# Altium project SlimmeMeterESP.PrjPcb
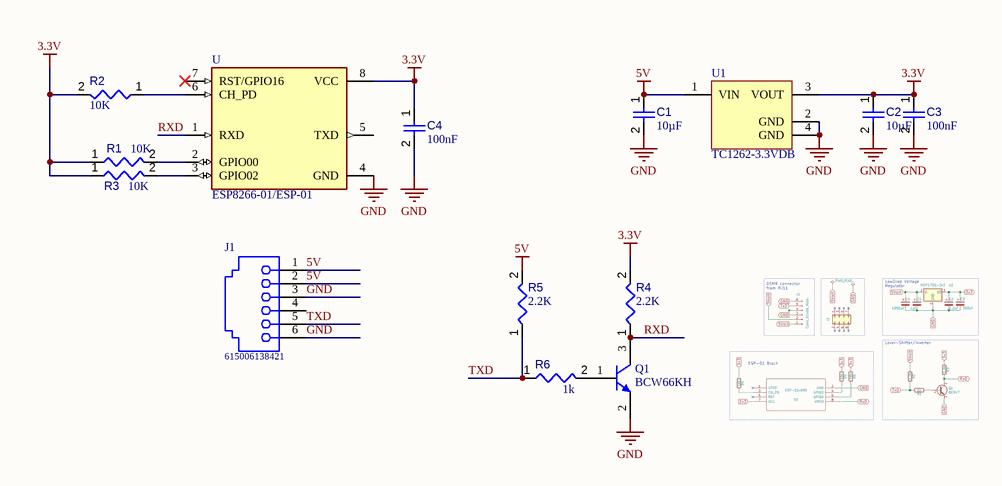
[diagram p0: Schema.SchDoc]
1 sheet, 14 parts. Net scope: global (net labels, ports and power ports of the same name join across sheets).
Board file: Schema.PcbDoc

## Sheet Schema.SchDoc
size A4; SheetNumber: 1; SheetTotal: 1

### Parts
C1  value 10µF  [CAPC0805(2012)145_L]  (hidden comment: Capacitor 10µF +/-20% 25V 0805)
C2  value 10µF  [CAPC0805(2012)145_L]  (hidden comment: Capacitor 10µF +/-20% 25V 0805)
C3  value 100nF  [CAPC1608X90X40NL10T20]  (hidden comment: Capacitor 100 nF +/-10% 50 V 0603)
C4  value 100nF  [CAPC1608X90X40NL10T20]  (hidden comment: Capacitor 100 nF +/-10% 50 V 0603)
J1  615006138421  [615006138421]
Q1  BCW66KH  [INF-SOT23_L]
R1  value 10K  [RESC1608X55X25ML10T15]  (hidden comment: Resistor 100k +/-1% 0603 100 mW)
R2  value 10K  [RESC1608X55X25ML10T15]  (hidden comment: Resistor 100k +/-1% 0603 100 mW)
R3  value 10K  [RESC1608X55X25ML10T15]  (hidden comment: Resistor 100k +/-1% 0603 100 mW)
R4  value 2.2K  [RESC1608X55X25ML10T15]  (hidden comment: Resistor 100k +/-1% 0603 100 mW)
R5  value 2.2K  [RESC1608X55X25ML10T15]  (hidden comment: Resistor 100k +/-1% 0603 100 mW)
R6  value 1k  [RESC1608X55X25ML10T15]  (hidden comment: Resistor 100k +/-1% 0603 100 mW)
U  ESP8266-01/ESP-01  [XCVR_ESP8266-01/ESP-01]
U1  TC1262-3.3VDB  [SOT-223-DB3_L]

### Nets
3.3V: C2.1 C3.1 C4.1 R1.1 R2.2 R3.1 R4.2 U.8(VCC) U1.3(VOUT)
5V: C1.1 J1.1 J1.2 R5.2 U1.1(VIN)
GND: C1.2 C2.2 C3.2 C4.2 J1.3 J1.6 Q1.2(E) U.4(GND) U1.2(GND) U1.4(GND)
RXD: Q1.3(C) R4.1 U.1(RXD)
TXD: J1.5 R5.1 R6.1
NetQ1_1: Q1.1(B) R6.2
NetR1_2: R1.2 U.2(GPIO00)
NetR2_1: R2.1 U.6(CH_PD)
NetR3_2: R3.2 U.3(GPIO02)

Not connected (* = marked no-connect by the designer): J1 4; U 5(TXD) 7(RST/GPIO16)*

### Library data of the parts
C1 C2 = CMP-001-00079-3: Chip Capacitor, 10µF +/-20%, 25V, 0805, Thickness 1.45 mm; Tolerance: 10%; Pins: 2; Case/Package: 0805; Voltage Rating: 25V; Min Operating Temperature: -55°C; Max Operating Temperature: 85°C; Mounting Technology: SMT
C3 C4 = CMP-001-00017-5: Chip Capacitor, 100 nF, +/- 10%, 50 V, 0603 (1608 Metric); Voltage Rating: 50V; Capacitor Type: Ceramic; Mounting Technology: SM; Case/Package: 0603; Tolerance: 10%; Max Operating Temperature: 125°C; Min Operating Temperature: -55°C; Pins: 2; RoHS Compliant: True
J1 = CMP-1502-01673-1: Modular Jack WR-MJ, Tab Up, Plastic, Horizontal Entry, THT, 6P6C; Manufacturer: Wurth Elektronik; Contact Resistance: 20mOhm; Working Voltage: 120VAC; Withstanding Voltage: 1000VAC; Compliance: Leadfree/RoHS; Rated Current: 1.5A; Port: 1x1; Mounting Technology: THT; Pin Number: 6P6C; Part Number: 615006138421; Publisher: WurthElektronik; Manufacturer URL: http://www.we-online.de; Operating Temperature: -40to85degC; Datasheet URL: https://katalog.we-online.com/em/datasheet/615006138421.pdf; Packaging: Tray; Entrance: Horizontal; Package Reference: 615006138421
Q1 = CMP-1177-00067-1: NPN Silicon AF Transistor, 45 V VCEO, 800 mA IC, SOT23, Reel, Green; Manufacturer: Infineon; VCE: 1 V; IC: 100Â mA; IC (max): 800Â mA; ICBO (max): 20Â nA; VCBO (max): 75Â V; fT (typ): 170Â MHz; VCEO (max): 45 V; Green: TRUE; Ptot (max): 500 mW; ICM (max): 1,000Â mA; IBM (max): 200Â mA; VEBO (max): 5Â V; PackageDescription: 3-Pin Small Outline Transistor Package, 1.3 x 2.9 mm Body, 0.95 mm Pitch; PackageReference: SOT23; ComponentLink1Description: Manufacturer URL; Polarity: NPN; PackageVersion: Apr-08; PartNumber: BCW66KH; ComponentLink3URL: http://www.infineon.com/dgdl/SOT23-Package_Overview.pdf?folderId=db3a30431936bc4b0119532290053c66&fileId=db3a30431936bc4b0119533468123c85; Packing: Reel; Mounting Technology: Surface Mount; ComponentLink1URL: http://www.infineon.com/; ComponentLink3Description: Package Specification; ComponentLink2Description: Datasheet; ComponentLink2URL: http://www.infineon.com/dgdl/bcw66k.pdf?folderId=db3a304314dca389011545f4eb561884&fileId=db3a304314dca389011547504ebe1a07
R1-R6 = CMP-009-00023-4: Chip Resistor, 100 KOhm, +/- 1%, 0.1 W, -55 to 155 degC, 0603 (1608 Metric); Power: 100mW; Voltage Rating: 50V; Max Operating Temperature: 155°C; Min Operating Temperature: -55°C; RoHS Compliant: True; Pins: 2; Case/Package: 0603; Mounting Technology: SM; Tolerance: 1%
U = ESP8266-01/ESP-01: ESP-01 wifi module; MF: AI-Thinker; Package: None; Availability: Unavailable; MP: ESP8266-01/ESP-01; Value: *; SnapEDA_Link: https://www.snapeda.com/parts/ESP8266-01/ESP-01/AI-Thinker/view-part/106413/?ref=snap; Price: None
U1 = CMP-0136-00483-1: 500mA Fixed Output CMOS LDO, 3-Pin SOT-223, Extended Temperature; PackageVersion: revBB, Aug-2009; DatasheetVersion: revB, 2002; PackageDescription: 3-Lead Plastic Small Outline Transistor (DB) [SOT-223]; PackageReference: SOT-223-DB3